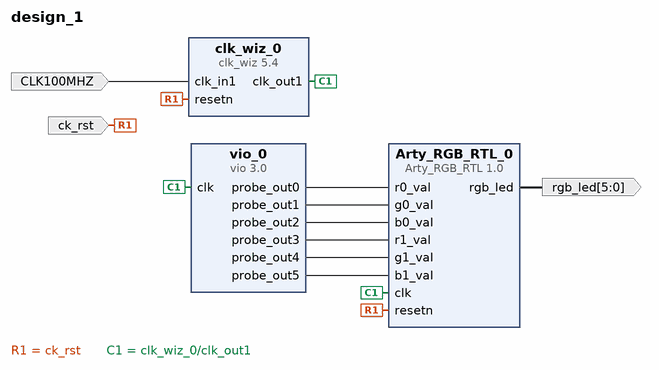
[diagram p0: block diagram of the top level]
# Vivado block design design_1, xc7s50csga324-1, Vivado 2017.4
create_bd_design design_1

create_bd_port -dir I -type clk CLK100MHZ
set_property -dict {CONFIG.FREQ_HZ 100000000 CONFIG.PHASE 0.000 CONFIG.ASSOCIATED_RESET ck_rst} [get_bd_ports CLK100MHZ]
create_bd_port -dir I -type rst ck_rst
set_property -dict {CONFIG.POLARITY ACTIVE_LOW} [get_bd_ports ck_rst]
create_bd_port -dir O -from 5 -to 0 rgb_led

create_bd_cell -type ip -vlnv xilinx.com:ip:clk_wiz:5.4 clk_wiz_0
set_property -dict [list \
  CONFIG.USE_LOCKED false \
  CONFIG.RESET_PORT resetn \
  CONFIG.RESET_TYPE ACTIVE_LOW \
  CONFIG.USE_BOARD_FLOW true \
  CONFIG.CLK_IN1_BOARD_INTERFACE ddr_clock \
  CONFIG.RESET_BOARD_INTERFACE reset \
] [get_bd_cells clk_wiz_0]
create_bd_cell -type ip -vlnv xilinx.com:ip:vio:3.0 vio_0
set_property -dict [list \
  CONFIG.C_PROBE_OUT5_WIDTH 8 \
  CONFIG.C_PROBE_OUT4_WIDTH 8 \
  CONFIG.C_PROBE_OUT3_WIDTH 8 \
  CONFIG.C_PROBE_OUT2_WIDTH 8 \
  CONFIG.C_PROBE_OUT1_WIDTH 8 \
  CONFIG.C_PROBE_OUT0_WIDTH 8 \
  CONFIG.C_NUM_PROBE_OUT 6 \
  CONFIG.C_NUM_PROBE_IN 0 \
] [get_bd_cells vio_0]
create_bd_cell -type ip -vlnv xilinx.com:user:Arty_RGB_RTL:1.0 Arty_RGB_RTL_0

# ---- connections ----

connect_bd_net -net ddr_clock_1 [get_bd_ports CLK100MHZ] [get_bd_pins clk_wiz_0/clk_in1]
connect_bd_net -net reset_1 [get_bd_ports ck_rst] [get_bd_pins clk_wiz_0/resetn] [get_bd_pins Arty_RGB_RTL_0/resetn]
connect_bd_net [get_bd_pins clk_wiz_0/clk_out1] [get_bd_pins vio_0/clk] [get_bd_pins Arty_RGB_RTL_0/clk]
connect_bd_net [get_bd_pins vio_0/probe_out0] [get_bd_pins Arty_RGB_RTL_0/r0_val]
connect_bd_net [get_bd_pins vio_0/probe_out1] [get_bd_pins Arty_RGB_RTL_0/g0_val]
connect_bd_net [get_bd_pins vio_0/probe_out2] [get_bd_pins Arty_RGB_RTL_0/b0_val]
connect_bd_net [get_bd_pins vio_0/probe_out3] [get_bd_pins Arty_RGB_RTL_0/r1_val]
connect_bd_net [get_bd_pins vio_0/probe_out4] [get_bd_pins Arty_RGB_RTL_0/g1_val]
connect_bd_net [get_bd_pins vio_0/probe_out5] [get_bd_pins Arty_RGB_RTL_0/b1_val]
connect_bd_net [get_bd_pins Arty_RGB_RTL_0/rgb_led] [get_bd_ports rgb_led]

validate_bd_design
save_bd_design
